# Altium project PCB_Project.PrjPcb
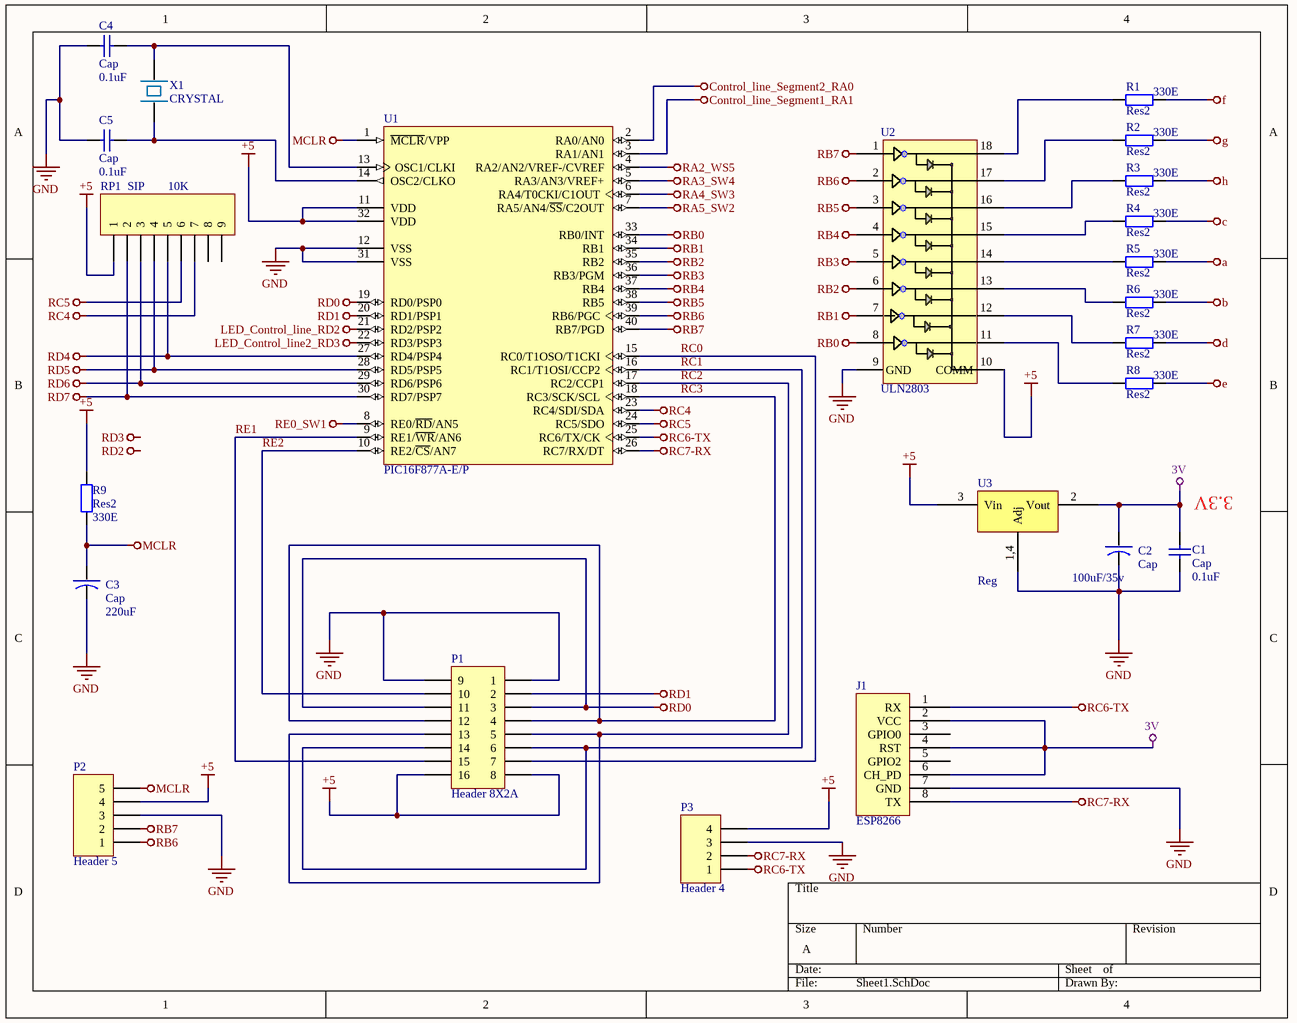
[diagram p0: Sheet1.SchDoc]
3 sheets, 76 parts. Net scope: global (net labels, ports and power ports of the same name join across sheets).
Board file: PCB1.PcbDoc
Sheets:
  Sheet1.SchDoc
  Sheet2.SchDoc
  Sheet3.SchDoc

## Sheet Sheet1.SchDoc
size A

### Parts
C1  Cap  [RES0805]
C2  Cap  value 100uF/35v  [Capacitor10UF/63V]
C3  Cap  [CAP_220uF]
C4  Cap  [CAP_104]
C5  Cap  [CAP_104]
J1  ESP8266  [ESP8266]
P1  Header 8X2A  [HDR2X8_CEN]
P2  Header 5  [HDR1X5]
P3  Header 4  [HDR1X4]
R1  Res2  value 330E  [AXIAL-0.4]
R2  Res2  value 330E  [AXIAL-0.4]
R3  Res2  value 330E  [AXIAL-0.4]
R4  Res2  value 330E  [AXIAL-0.4]
R5  Res2  value 330E  [AXIAL-0.4]
R6  Res2  value 330E  [AXIAL-0.4]
R7  Res2  value 330E  [AXIAL-0.4]
R8  Res2  value 330E  [AXIAL-0.4]
R9  Res2  value 330E  [AXIAL-0.4]
RP1  SIP  value 10K  [HDR1X9]
U1  PIC16F877A-E/P  [PDIP600-P40]
U2  ULN2803  [ULN2803]
U3  Reg  [LM1117]
X1  CRYSTAL  [CRYSTAL]

### Nets
3V: C1.2(A) C2.1(a) J1.2(VCC) J1.4(RST) J1.6(CH_PD) U3.2(Vout)
+5: P1.8 P1.16 P2.4 P3.4 R9.2 RP1.1 U1.11(VDD) U1.32(VDD) U2.10(COMM) U3.3(Vin)
a: R5.2
b: R6.2
c: R4.2
Control_line_Segment1_RA1: U1.3(RA1/AN1)
Control_line_Segment2_RA0: U1.2(RA0/AN0)
d: R7.2
e: R8.2
f: R1.2
g: R2.2
GND: C1.1(A) C2.2(b) C3.2(b) C4.1(A) C5.1(A) J1.7(GND) P1.1 P1.9 P2.3 P3.3 U1.12(VSS) U1.31(VSS) U2.9(GND) U3.1,4(Adj)
h: R3.2
LED_Control_line2_RD3: U1.22(RD3/PSP3)
LED_Control_line_RD2: U1.21(RD2/PSP2)
MCLR: C3.1(a) P2.5 R9.1 U1.1(~{MCLR}/VPP)
RA2_WS5: U1.4(RA2/AN2/VREF-/CVREF)
RA3_SW4: U1.5(RA3/AN3/VREF+)
RA4_SW3: U1.6(RA4/T0CKI/C1OUT)
RA5_SW2: U1.7(RA5/AN4/~{SS}/C2OUT)
RB0: U1.33(RB0/INT) U2.8
RB1: U1.34(RB1) U2.7
RB2: U1.35(RB2) U2.6
RB3: U1.36(RB3/PGM) U2.5
RB4: U1.37(RB4) U2.4
RB5: U1.38(RB5) U2.3
RB6: P2.1 U1.39(RB6/PGC) U2.2
RB7: P2.2 U1.40(RB7/PGD) U2.1
RC4: RP1.7 U1.23(RC4/SDI/SDA)
RC5: RP1.6 U1.24(RC5/SDO)
RC6-TX: J1.1(RX) P3.1 U1.25(RC6/TX/CK)
RC7-RX: J1.8(TX) P3.2 U1.26(RC7/RX/DT)
RD0: P1.3 P1.11 U1.19(RD0/PSP0)
RD1: P1.2 U1.20(RD1/PSP1)
RD4: RP1.5 U1.27(RD4/PSP4)
RD5: RP1.4 U1.28(RD5/PSP5)
RD6: RP1.3 U1.29(RD6/PSP6)
RD7: RP1.2 U1.30(RD7/PSP7)
RE0_SW1: U1.8(RE0/~{RD}/AN5)
RC0: P1.7 U1.15(RC0/T1OSO/T1CKI)
RC1: P1.6 P1.14 U1.16(RC1/T1OSI/CCP2)
RC2: P1.5 P1.13 U1.17(RC2/CCP1)
RC3: P1.4 P1.12 U1.18(RC3/SCK/SCL)
RE1: P1.15 U1.9(RE1/~{WR}/AN6)
RE2: P1.10 U1.10(RE2/~{CS}/AN7)
NetC4_2: C4.2(A) U1.13(OSC1/CLKI) X1.2(b)
NetC5_2: C5.2(A) U1.14(OSC2/CLKO) X1.1(a)
NetR1_1: R1.1 U2.18
NetR2_1: R2.1 U2.17
NetR3_1: R3.1 U2.16
NetR4_1: R4.1 U2.15
NetR5_1: R5.1 U2.14
NetR6_1: R6.1 U2.13
NetR7_1: R7.1 U2.12
NetR8_1: R8.1 U2.11

Not connected (* = marked no-connect by the designer): J1 3(GPIO0) 5(GPIO2); RP1 8 9

### Notes on the sheet
- (near C1) 3.3V
- Labels drawn without touching a wire or pin: RD2, RD3
- (in symbol CAP_104) 0.1uF
- (in symbol CAP_104_SMD) 0.1uF
- (in symbol CAP_220uF) 220uF

### Library data of the parts
C1 = CAP_104_SMD
C2 = Cap-10uf/63V: Cap10uf/63V
C3 = CAP_220uF
C4 C5 = CAP_104
J1 = ESP8266: WIFI Module
P1 = Header 8X2A: Header, 8-Pin, Dual row; LatestRevisionDate: 17-Jul-2002; LatestRevisionNote: Re-released for DXP Platform.; Publisher: Altium Limited
P2 = Header 5: Header, 5-Pin; LatestRevisionDate: 17-Jul-2002; LatestRevisionNote: Re-released for DXP Platform.; Publisher: Altium Limited
P3 = Header 4: Header, 4-Pin; LatestRevisionDate: 17-Jul-2002; LatestRevisionNote: Re-released for DXP Platform.; Publisher: Altium Limited
R1-R9 = Res2: Resistor; Published: 8-Jun-2000; LatestRevisionDate: 17-Jul-2002; LatestRevisionNote: Re-released for DXP Platform.; PackageReference: AXIAL-0.4; Publisher: Altium Limited; PackageDescription: Axial Device, Thru-Hole; 2 Leads; 0.4 in Pin Spacing
RP1 = Header 9: Network resistor 9 pin; LatestRevisionDate: 17-Jul-2002; LatestRevisionNote: Re-released for DXP Platform.; Publisher: Altium Limited
U1 = PIC16F877A-E/P: Enhanced FLASH Microcontroller, 8K (x14-Bit words) FLASH, 368 Bytes RAM, 40-Pin PDIP, Standard VDD Range, Extended Temperature; ComponentAvailability: Unknown. Contact manufacturer to determine status.; Published: 11-Oct-2004; LatestRevisionDate: 29-Jan-2009; LatestRevisionNote: Sch. layout revised. 3D Model Removed.; DatasheetVersion: revB, Oct-2003; PackageVersion: revBB, Aug-2009; PackageReference: PDIP600-P40; Publisher: Altium Limited; PackageDescription: 40-Lead Plastic Dual In-Line (P) - 600 mil Body [PDIP]; Supplier 1: Digi-Key; Supplier Part Number 1: PIC16F877A-E/P-ND; Supplier 2: Farnell; Supplier Part Number 2: 1567990; ComponentLink1Description: Datasheet; ComponentLink1URL: http://ww1.microchip.com/downloads/en/DeviceDoc/39582b.pdf; ComponentLink2Description: Packaging Specification; ComponentLink2URL: http://www.microchip.com/stellent/groups/techpub_sg/documents/packagingspec/en012702.pdf; ComponentLink3Description: Microchip.com Home; ComponentLink3URL: http://www.microchip.com/
U2 = ULN2803: 􀃯voltage,  high􀃯current darlington drivers comprised of eight NPN  darlington pairs.  All units feature integral clamp diodes for
U3 = LM1117

## Sheet Sheet2.SchDoc
size A
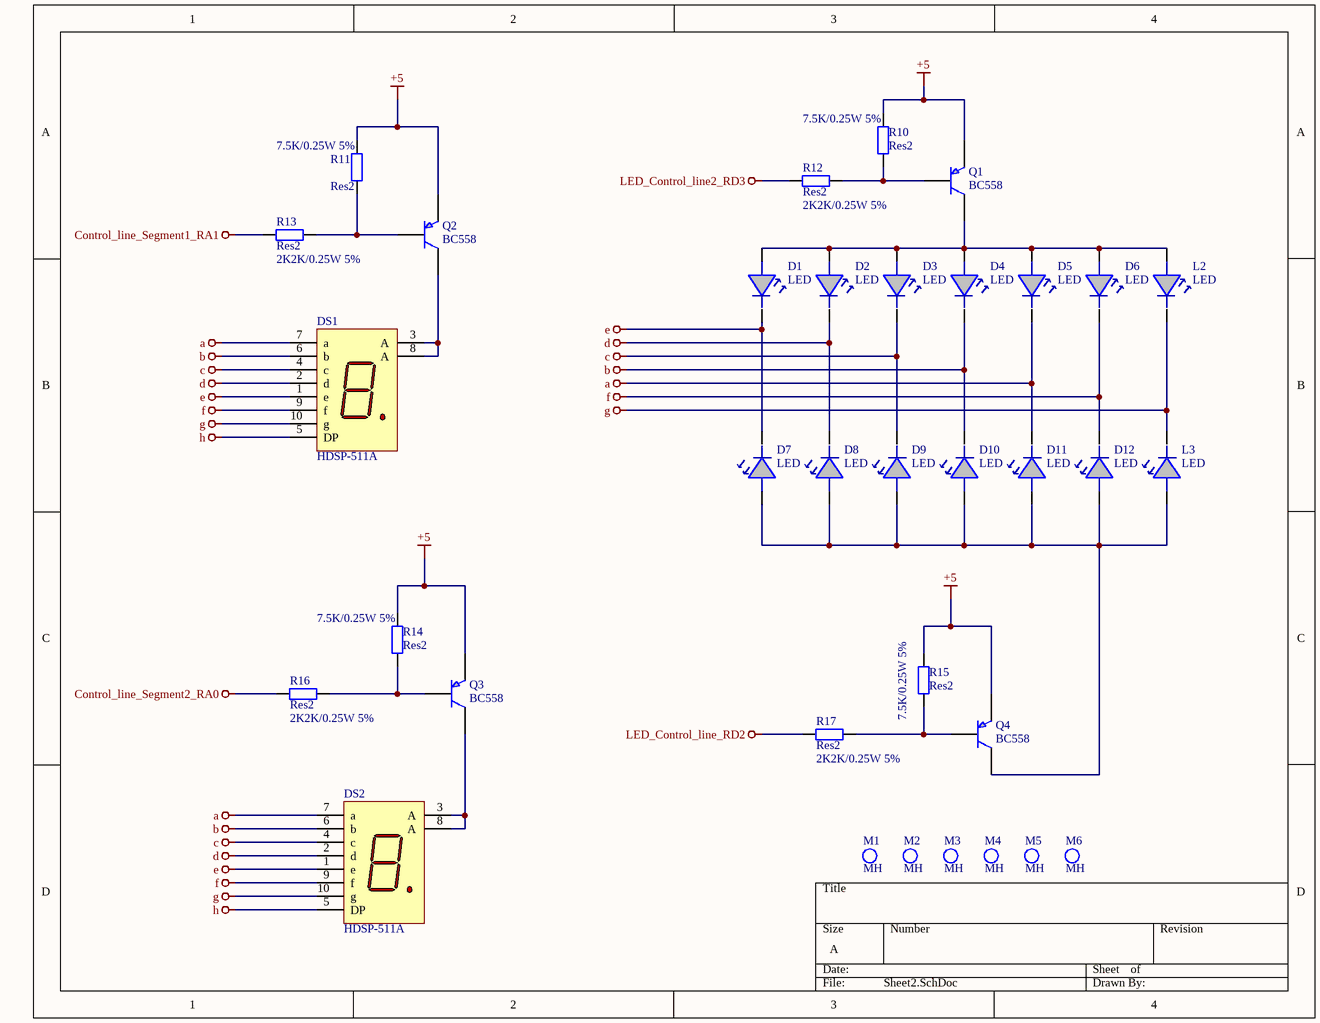
[diagram p1: Sheet2.SchDoc]

### Parts
D1  LED  [LED5MM]
D2  LED  [LED5MM]
D3  LED  [LED5MM]
D4  LED  [LED5MM]
D5  LED  [LED5MM]
D6  LED  [LED5MM]
D7  LED  [LED5MM]
D8  LED  [LED5MM]
D9  LED  [LED5MM]
D10  LED  [LED5MM]
D11  LED  [LED5MM]
D12  LED  [LED5MM]
DS1  HDSP-511A  [HDSP-51]
DS2  HDSP-511A  [HDSP-51]
L2  LED  [LED5MM]
L3  LED  [LED5MM]
M1  MH  [Mounting hole]
M2  MH  [Mounting hole]
M3  MH  [Mounting hole]
M4  MH  [Mounting hole]
M5  MH  [Mounting hole]
M6  MH  [Mounting hole]
Q1  BC558  [TRANSISTOR_BC548]
Q2  BC558  [TRANSISTOR_BC548]
Q3  BC558  [TRANSISTOR_BC548]
Q4  BC558  [TRANSISTOR_BC548]
R10  Res2  value 7.5K/0.25W 5%  [AXIAL-0.4]
R11  Res2  value 7.5K/0.25W 5%  [AXIAL-0.4]
R12  Res2  value 2K2K/0.25W 5%  [AXIAL-0.4]
R13  Res2  value 2K2K/0.25W 5%  [AXIAL-0.4]
R14  Res2  value 7.5K/0.25W 5%  [AXIAL-0.4]
R15  Res2  value 7.5K/0.25W 5%  [AXIAL-0.4]
R16  Res2  value 2K2K/0.25W 5%  [AXIAL-0.4]
R17  Res2  value 2K2K/0.25W 5%  [AXIAL-0.4]

### Nets
+5: Q1.3(E) Q2.3(E) Q3.3(E) Q4.3(E) R10.2 R11.2 R14.2 R15.2
a: D5.2(B) D11.2(B) DS1.7(a) DS2.7(a)
b: D4.2(B) D10.2(B) DS1.6(b) DS2.6(b)
c: D3.2(B) D9.2(B) DS1.4(c) DS2.4(c)
Control_line_Segment1_RA1: R13.2
Control_line_Segment2_RA0: R16.2
d: D2.2(B) D8.2(B) DS1.2(d) DS2.2(d)
e: D1.2(B) D7.2(B) DS1.1(e) DS2.1(e)
f: D6.2(B) D12.2(B) DS1.9(f) DS2.9(f)
g: DS1.10(g) DS2.10(g) L2.2(B) L3.2(B)
h: DS1.5(DP) DS2.5(DP)
LED_Control_line2_RD3: R12.2
LED_Control_line_RD2: R17.2
NetD1_1: D1.1(A) D2.1(A) D3.1(A) D4.1(A) D5.1(A) D6.1(A) L2.1(A) Q1.1(C)
NetD7_1: D7.1(A) D8.1(A) D9.1(A) D10.1(A) D11.1(A) D12.1(A) L3.1(A) Q4.1(C)
NetDS1_3: DS1.3(A) DS1.8(A) Q2.1(C)
NetDS2_3: DS2.3(A) DS2.8(A) Q3.1(C)
NetQ1_2: Q1.2(B) R10.1 R12.1
NetQ2_2: Q2.2(B) R11.1 R13.1
NetQ3_2: Q3.2(B) R14.1 R16.1
NetQ4_2: Q4.2(B) R15.1 R17.1

### Library data of the parts
D1-D12 L2 L3 = LED_5MM
DS1 DS2 = HDSP-511A: 14.22 mm General Purpose AlGaAs Red 7-Segment Display: CA, RH DP; LuminousIntensity: 3201 ucd (Minimum).; Published: 26-May-2004; LatestRevisionDate: 11-Oct-2004; LatestRevisionNote: Display outline superimposed on PCB Footprint.; DatasheetDocument: 25-Jul-2001; PackageDocument: 25-Jul-2001; PackageReference: HDSP-51; Publisher: Altium Limited; LED_Colour: AlGaAs Red; ComponentLink1Description: Manufacturer Link; ComponentLink1URL: http://www.agilent.com/; ComponentLink2Description: Datasheet; ComponentLink2URL: http://cp.literature.agilent.com/litweb/pdf/5988-2968EN.pdf
Q1-Q4 = BC558: PNP
R10-R17 = Res2: Resistor; Published: 8-Jun-2000; LatestRevisionDate: 17-Jul-2002; LatestRevisionNote: Re-released for DXP Platform.; PackageReference: AXIAL-0.4; Publisher: Altium Limited; PackageDescription: Axial Device, Thru-Hole; 2 Leads; 0.4 in Pin Spacing

## Sheet Sheet3.SchDoc
size A
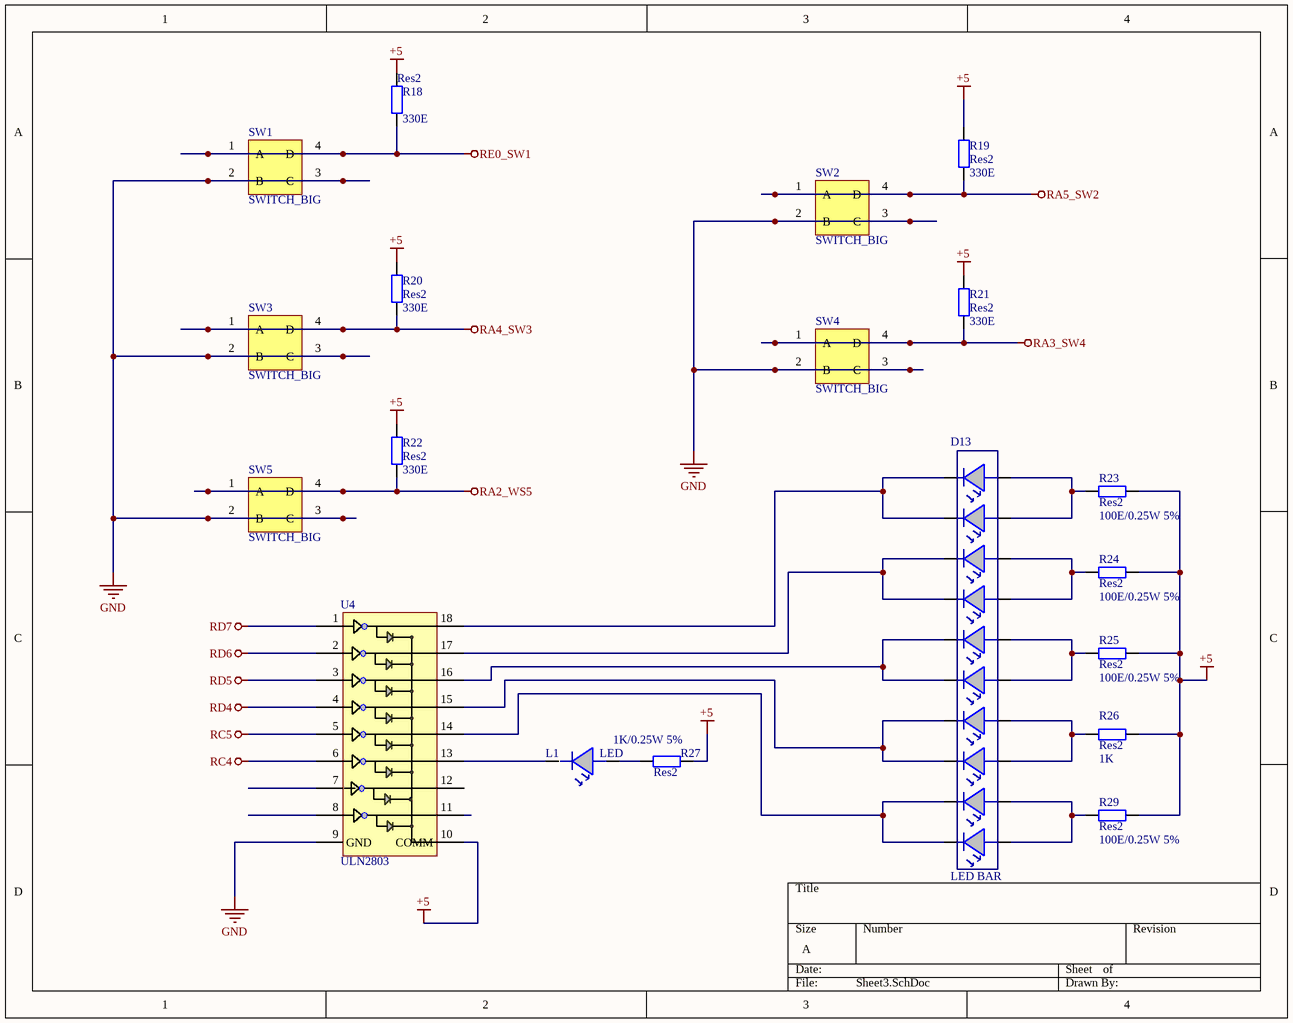
[diagram p2: Sheet3.SchDoc]

### Parts
D13  LED BAR  [LED_BAR]
L1  LED  [LED5MM]
R18  Res2  value 330E  [AXIAL-0.4]
R19  Res2  value 330E  [AXIAL-0.4]
R20  Res2  value 330E  [AXIAL-0.4]
R21  Res2  value 330E  [AXIAL-0.4]
R22  Res2  value 330E  [AXIAL-0.4]
R23  Res2  value 100E/0.25W 5%  [AXIAL-0.4]
R24  Res2  value 100E/0.25W 5%  [AXIAL-0.4]
R25  Res2  value 100E/0.25W 5%  [AXIAL-0.4]
R26  Res2  value 1K  [AXIAL-0.4]
R27  Res2  value 1K/0.25W 5%  [AXIAL-0.4]
R29  Res2  value 100E/0.25W 5%  [AXIAL-0.4]
SW1  SWITCH_BIG  [SWITCH - BIG]
SW2  SWITCH_BIG  [SWITCH - BIG]
SW3  SWITCH_BIG  [SWITCH - BIG]
SW4  SWITCH_BIG  [SWITCH - BIG]
SW5  SWITCH_BIG  [SWITCH - BIG]
U4  ULN2803  [ULN2803]

### Nets
+5: R18.2 R19.2 R20.2 R21.2 R22.2 R23.2 R24.2 R25.2 R26.2 R27.1 R29.2 U4.10(COMM)
GND: SW1.2(B) SW1.3(C) SW2.2(B) SW2.3(C) SW3.2(B) SW3.3(C) SW4.2(B) SW4.3(C) SW5.2(B) SW5.3(C) U4.9(GND)
RA2_WS5: R22.1 SW5.1(A) SW5.4(D)
RA3_SW4: R21.1 SW4.1(A) SW4.4(D)
RA4_SW3: R20.1 SW3.1(A) SW3.4(D)
RA5_SW2: R19.1 SW2.1(A) SW2.4(D)
RC4: U4.6
RC5: U4.5
RD4: U4.4
RD5: U4.3
RD6: U4.2
RD7: U4.1
RE0_SW1: R18.1 SW1.1(A) SW1.4(D)
NetD13_1: D13.1 D13.2 R29.1
NetD13_3: D13.3 D13.4 R26.1
NetD13_5: D13.5 D13.6 R25.1
NetD13_7: D13.7 D13.8 R24.1
NetD13_9: D13.9 D13.10 R23.1
NetD13_11: D13.11 D13.12 U4.18
NetD13_13: D13.13 D13.14 U4.17
NetD13_15: D13.15 D13.16 U4.16
NetD13_17: D13.17 D13.18 U4.15
NetD13_19: D13.19 D13.20 U4.14
NetL1_1: L1.1(A) R27.2
NetL1_2: L1.2(B) U4.13

Not connected (* = marked no-connect by the designer): U4 7 8 11 12

### Library data of the parts
D13 = LED_BAR
L1 = LED_5MM
R18-R27 R29 = Res2: Resistor; Published: 8-Jun-2000; LatestRevisionDate: 17-Jul-2002; LatestRevisionNote: Re-released for DXP Platform.; PackageReference: AXIAL-0.4; Publisher: Altium Limited; PackageDescription: Axial Device, Thru-Hole; 2 Leads; 0.4 in Pin Spacing
SW1-SW5 = SWITCH_BIG: Big size
U4 = ULN2803: as U2 on sheet Sheet1

## Nets that join several sheets
+5: Sheet1 (10 pins), Sheet2 (8 pins), Sheet3 (12 pins)
a: Sheet1 (R5.2), Sheet2 (D5.2 D11.2 DS1.7 DS2.7)
b: Sheet1 (R6.2), Sheet2 (D4.2 D10.2 DS1.6 DS2.6)
c: Sheet1 (R4.2), Sheet2 (D3.2 D9.2 DS1.4 DS2.4)
Control_line_Segment1_RA1: Sheet1 (U1.3), Sheet2 (R13.2)
Control_line_Segment2_RA0: Sheet1 (U1.2), Sheet2 (R16.2)
d: Sheet1 (R7.2), Sheet2 (D2.2 D8.2 DS1.2 DS2.2)
e: Sheet1 (R8.2), Sheet2 (D1.2 D7.2 DS1.1 DS2.1)
f: Sheet1 (R1.2), Sheet2 (D6.2 D12.2 DS1.9 DS2.9)
g: Sheet1 (R2.2), Sheet2 (DS1.10 DS2.10 L2.2 L3.2)
GND: Sheet1 (14 pins), Sheet3 (11 pins)
h: Sheet1 (R3.2), Sheet2 (DS1.5 DS2.5)
LED_Control_line2_RD3: Sheet1 (U1.22), Sheet2 (R12.2)
LED_Control_line_RD2: Sheet1 (U1.21), Sheet2 (R17.2)
RA2_WS5: Sheet1 (U1.4), Sheet3 (R22.1 SW5.1 SW5.4)
RA3_SW4: Sheet1 (U1.5), Sheet3 (R21.1 SW4.1 SW4.4)
RA4_SW3: Sheet1 (U1.6), Sheet3 (R20.1 SW3.1 SW3.4)
RA5_SW2: Sheet1 (U1.7), Sheet3 (R19.1 SW2.1 SW2.4)
RC4: Sheet1 (RP1.7 U1.23), Sheet3 (U4.6)
RC5: Sheet1 (RP1.6 U1.24), Sheet3 (U4.5)
RD4: Sheet1 (RP1.5 U1.27), Sheet3 (U4.4)
RD5: Sheet1 (RP1.4 U1.28), Sheet3 (U4.3)
RD6: Sheet1 (RP1.3 U1.29), Sheet3 (U4.2)
RD7: Sheet1 (RP1.2 U1.30), Sheet3 (U4.1)
RE0_SW1: Sheet1 (U1.8), Sheet3 (R18.1 SW1.1 SW1.4)